# EAGLE schematic at32uc3a3256_usb_i2s (EAGLE 6.6.0)
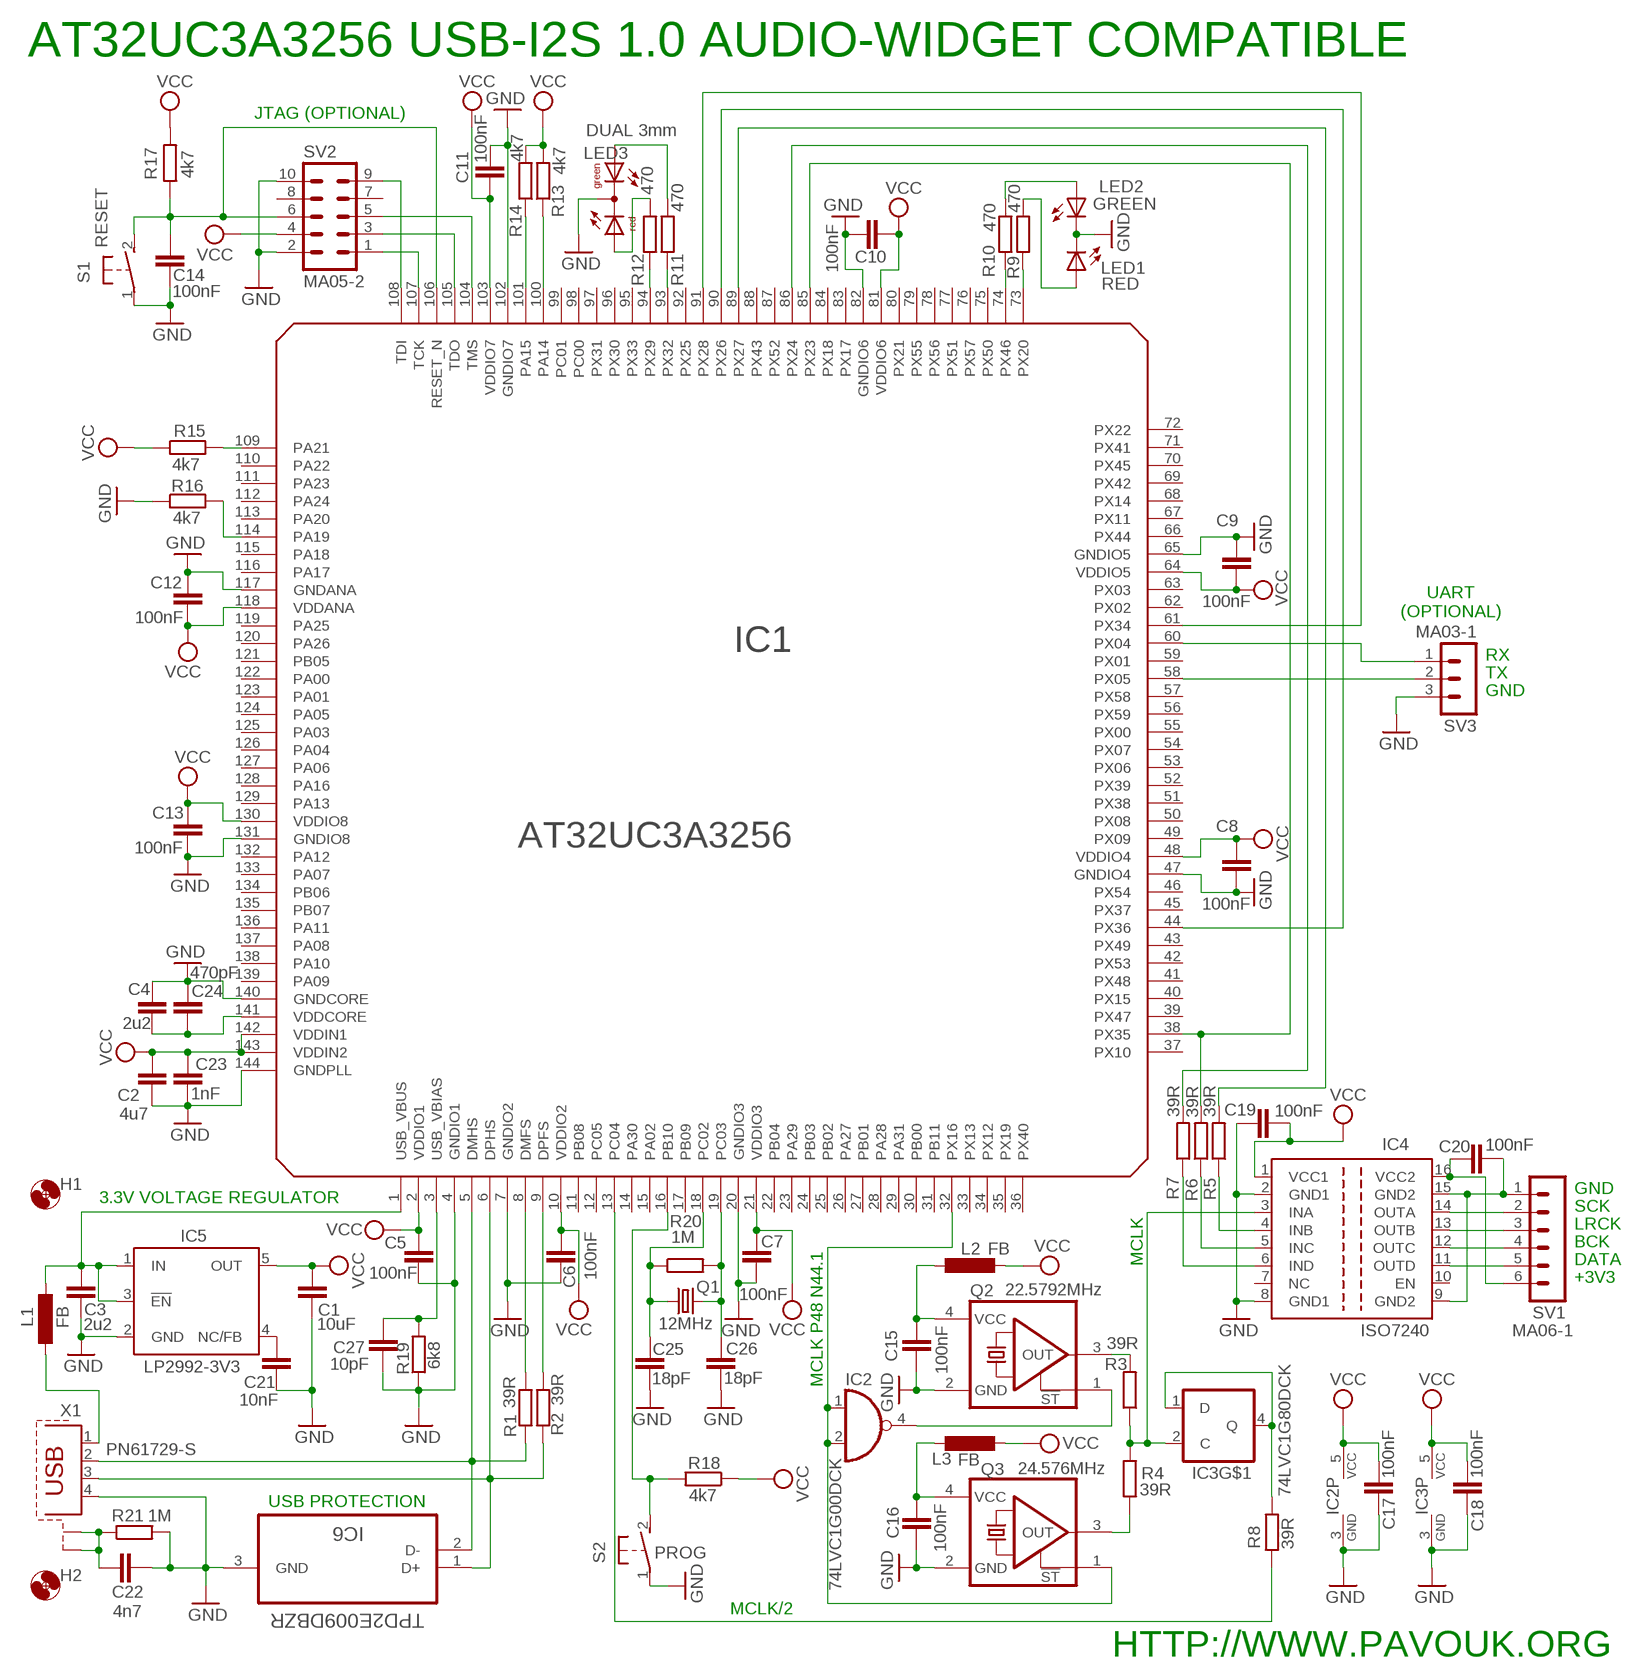
[diagram p0: schematic, sheet 1]

## Parts
C1  10uF  C-EUC0603  [C0603]
C2  4u7  C-EUC0603  [C0603]
C3  2u2  C-EUC0603  [C0603]
C4  2u2  C-EUC0603  [C0603]
C5  100nF  C-EUC0603  [C0603]
C6  100nF  C-EUC0603  [C0603]
C7  100nF  C-EUC0603  [C0603]
C8  100nF  C-EUC0603  [C0603]
C9  100nF  C-EUC0603  [C0603]
C10  100nF  C-EUC0603  [C0603]
C11  100nF  C-EUC0603  [C0603]
C12  100nF  C-EUC0603  [C0603]
C13  100nF  C-EUC0603  [C0603]
C14  100nF  C-EUC0603  [C0603]
C15  100nF  C-EUC0603  [C0603]
C16  100nF  C-EUC0603  [C0603]
C17  100nF  C-EUC0603  [C0603]
C18  100nF  C-EUC0603  [C0603]
C19  100nF  C-EUC0603  [C0603]
C20  100nF  C-EUC0603  [C0603]
C21  10nF  C-EUC0603  [C0603]
C22  4n7  C-EUC0603  [C0603]
C23  1nF  C-EUC0603  [C0603]
C24  470pF  C-EUC0603  [C0603]
C25  18pF  C-EUC0603  [C0603]
C26  18pF  C-EUC0603  [C0603]
C27  10pF  C-EUC0603  [C0603]
H1  MOUNT-HOLE3.2  [3,2]
H2  MOUNT-HOLE3.2  [3,2]
IC1  AT32UC3A3256  [LQFP144]
IC2  74LVC1G00DCK  [SC70-5]
IC3  74LVC1G80DCK  74LVC1G79DCK  [SC70-5]
IC4  ISO7240  [SO-16DW]
IC5  LP2992-3V3  TPS77001  [SOT23-DBV]
IC6  TPD2E009DBZR  [SOT95P237X112-3N]
L1  FB  L-EUL2012C  [L2012C]
L2  FB  L-EUL2012C  [L2012C]
L3  FB  L-EUL2012C  [L2012C]
LED1  RED  LEDCHIPLED_0603  [CHIPLED_0603]
LED2  GREEN  LEDCHIPLED_0603  [CHIPLED_0603]
LED3  DUAL 3mm  DUOLED5MM  [DUOLED5MM]
Q1  12MHz  CRYSTALCTS406  [CTS406]
Q2  22.5792MHz  CRYSTAL2.5X2  [CRYSTAL2.5X2]
Q3  24.576MHz  CRYSTAL2.5X2  [CRYSTAL2.5X2]
R1  39R  R-EU_R0603  [R0603]
R2  39R  R-EU_R0603  [R0603]
R3  39R  R-EU_R0603  [R0603]
R4  39R  R-EU_R0603  [R0603]
R5  39R  R-EU_R0603  [R0603]
R6  39R  R-EU_R0603  [R0603]
R7  39R  R-EU_R0603  [R0603]
R8  39R  R-EU_R0603  [R0603]
R9  470  R-EU_R0603  [R0603]
R10  470  R-EU_R0603  [R0603]
R11  470  R-EU_R0603  [R0603]
R12  470  R-EU_R0603  [R0603]
R13  4k7  R-EU_R0603  [R0603]
R14  4k7  R-EU_R0603  [R0603]
R15  4k7  R-EU_R0603  [R0603]
R16  4k7  R-EU_R0603  [R0603]
R17  4k7  R-EU_R0603  [R0603]
R18  4k7  R-EU_R0603  [R0603]
R19  6k8  R-EU_R0603  [R0603]
R20  1M  R-EU_R0603  [R0603]
R21  1M  R-EU_R0603  [R0603]
S1  RESET  SWITCH-KSR  [SWITCH-KSR]
S2  PROG  SWITCH-KSR  [SWITCH-KSR]
SV1  MA06-1  [MA06-1]
SV2  MA05-2  [MA05-2]
SV3  MA03-1  [MA03-1]
X1  PN61729-S  [PN61729-S]

## Nets
AD_LRCK: IC1.44(PX36) IC1.90(PX26)
AD_SCLK: IC1.61(PX34) IC1.91(PX28)
DA_LRCK: IC1.89(PX27) R5.2
DA_SCLK: IC1.38(PX35) IC1.85(PX23) R6.2
GND: C1.2 C2.2 C3.2 C4.1 C5.2 C6.2 C7.2 C8.2 C9.1 C10.1 C11.1 C12.1 C13.1 C14.2 C15.1 C16.1 C17.2 C18.2 C19.1 C21.2 C22.2 C23.2 C24.1 C25.2 C26.2 C27.2 IC1.4(GNDIO1) IC1.7(GNDIO2) IC1.20(GNDIO3) IC1.47(GNDIO4) IC1.65(GNDIO5) IC1.82(GNDIO6) IC1.102(GNDIO7) IC1.117(GNDANA) IC1.131(GNDIO8) IC1.140(GNDCORE) IC1.144(GNDPLL) IC2.3(GND) IC3.3(GND) IC4.2(GND1) IC4.8(GND1) IC5.2(GND) IC6.3(GND) LED1.C LED2.C LED3.K(C) Q2.2(GND) Q3.2(GND) R16.1 R19.1 R21.2 S1.1 S2.1 SV2.2 SV2.10 SV3.3 X1.4
GND2: C20.2 IC4.9(GND2) IC4.15(GND2) SV1.1
GPIO_05_LED2: IC1.94(PX29) R12.1
GPIO_08_LED1: IC1.93(PX32) R11.1
LRCK: IC4.4(INB) R5.1
MCLK: IC3.2(C) IC4.3(INA) R3.1 R4.2
MCLK_MCU: IC1.13(PC04) R8.1
MCLK_P48_N441: IC1.32(PX16) IC2.1(I0) IC2.2(I1) Q3.1(!ST)
N$1: C15.2 L2.2 Q2.4(VCC)
N$2: IC1.5(DMHS) IC6.2(D-) R1.1 X1.2
N$3: Q3.3(OUT) R4.1
N$4: Q2.3(OUT) R3.2
N$5: C16.2 L3.2 Q3.4(VCC)
N$6: IC1.6(DPHS) IC6.1(D+) R2.1 X1.3
N$7: IC1.8(DMFS) R1.2
N$8: C26.1 IC1.19(PC03) Q1.3 R20.2
N$9: C25.1 IC1.18(PC02) Q1.1 R20.1
N$10: IC1.9(DPFS) R2.2
N$11: C4.2 C24.2 IC1.141(VDDCORE)
N$12: IC1.108(TDI) SV2.9
N$13: IC1.114(PA19) R16.2
N$14: C22.1 R21.1 X1.S1 X1.S2
N$15: C27.1 IC1.3(USB_VBIAS) R19.2
N$16: C20.1 IC4.16(VCC2) SV1.6
N$17: IC4.14(OUTA) SV1.2
N$18: IC4.13(OUTB) SV1.3
N$19: IC4.12(OUTC) SV1.4
N$20: LED1.A R9.2
N$21: LED2.A R10.2
N$22: IC1.74(PX46) R10.1
N$23: IC1.73(PX20) R9.1
N$24: IC1.109(PA21) R15.2
N$25: IC1.101(PA15) R14.1
N$26: IC1.100(PA14) R13.1
N$27: IC4.11(OUTD) SV1.5
N$28: IC4.5(INC) R6.1
N$29: IC1.86(PX24) R7.2
N$30: IC4.6(IND) R7.1
N$31: IC3.1(D) IC3.4(Q) R8.2
N$32: L1.1 X1.1
N$33: LED3.AG R11.2
N$34: C21.1 IC5.4(NC/FB)
N$35: LED3.AR R12.2
N$36: IC2.4(O) Q2.1(!ST)
NSRST: C14.1 IC1.106(RESET_N) R17.1 S1.2 SV2.6
PROG: IC1.16(PB10) R18.2 S2.2
TCK: IC1.107(TCK) SV2.1
TDO: IC1.105(TDO) SV2.3
TMS: IC1.104(TMS) SV2.5
UART_RX: IC1.60(PX04) SV3.1
UART_TX: IC1.58(PX05) SV3.2
VBUS: C3.1 IC1.1(USB_VBUS) IC5.1(IN) IC5.3(!EN) L1.2
VCC: C1.1 C2.1 C5.1 C6.1 C7.1 C8.1 C9.2 C10.2 C11.2 C12.2 C13.2 C17.1 C18.1 C19.2 C23.1 IC1.2(VDDIO1) IC1.10(VDDIO2) IC1.21(VDDIO3) IC1.48(VDDIO4) IC1.64(VDDIO5) IC1.81(VDDIO6) IC1.103(VDDIO7) IC1.118(VDDANA) IC1.130(VDDIO8) IC1.142(VDDIN1) IC1.143(VDDIN2) IC2.5(VCC) IC3.5(VCC) IC4.1(VCC1) IC5.5(OUT) L2.1 L3.1 R13.2 R14.2 R15.1 R17.2 R18.1 SV2.4
Unconnected: IC1.11(PB08) IC1.12(PC05) IC1.14(PA30) IC1.15(PA02) IC1.17(PB09) IC1.22(PB04) IC1.23(PA29) IC1.24(PB03) IC1.25(PB02) IC1.26(PA27) IC1.27(PB01) IC1.28(PA28) IC1.29(PA31) IC1.30(PB00) IC1.31(PB11) IC1.33(PX13) IC1.34(PX12) IC1.35(PX19) IC1.36(PX40) IC1.37(PX10) IC1.39(PX47) IC1.40(PX15) IC1.41(PX48) IC1.42(PX53) IC1.43(PX49) IC1.45(PX37) IC1.46(PX54) IC1.49(PX09) IC1.50(PX08) IC1.51(PX38) IC1.52(PX39) IC1.53(PX06) IC1.54(PX07) IC1.55(PX00) IC1.56(PX59) IC1.57(PX58) IC1.59(PX01) IC1.62(PX02) IC1.63(PX03) IC1.66(PX44) IC1.67(PX11) IC1.68(PX14) IC1.69(PX42) IC1.70(PX45) IC1.71(PX41) IC1.72(PX22) IC1.75(PX50) IC1.76(PX57) IC1.77(PX51) IC1.78(PX56) IC1.79(PX55) IC1.80(PX21) IC1.83(PX17) IC1.84(PX18) IC1.87(PX52) IC1.88(PX43) IC1.92(PX25) IC1.95(PX33) IC1.96(PX30) IC1.97(PX31) IC1.98(PC00) IC1.99(PC01) IC1.110(PA22) IC1.111(PA23) IC1.112(PA24) IC1.113(PA20) IC1.115(PA18) IC1.116(PA17) IC1.119(PA25) IC1.120(PA26) IC1.121(PB05) IC1.122(PA00) IC1.123(PA01) IC1.124(PA05) IC1.125(PA03) IC1.126(PA04) IC1.127(PA06) IC1.128(PA16) IC1.129(PA13) IC1.132(PA12) IC1.133(PA07) IC1.134(PB06) IC1.135(PB07) IC1.136(PA11) IC1.137(PA08) IC1.138(PA10) IC1.139(PA09) IC4.7(NC) IC4.10(EN) SV2.7 SV2.8

## Notes on the sheet
- AT32UC3A3256 USB-I2S 1.0 AUDIO-WIDGET COMPATIBLE
- JTAG (OPTIONAL)
- UART
  (OPTIONAL)
- RX
- TX
- GND
- GND
- 3.3V VOLTAGE REGULATOR
- SCK
- LRCK
- BCK
- MCLK | DATA
- +3V3
- MCLK P48 N44.1
- USB PROTECTION
- MCLK/2
- HTTP://WWW.PAVOUK.ORG

## Library data of the parts
C1-C27 = rcl:C-EU: CAPACITOR, European symbol
H1 H2 = holes:MOUNT-HOLE: MOUNTING HOLE with drill center marker
IC1 = at32uc:AT32UC3A3256
IC2 = 74xx-little-de:74*1G00: 2-input NAND gate
IC3 = 74xx-little-de:74*1G79: Single Positive-Edge-Triggered D-Type Flip-Flop Source: Data sheet <http://www.ti.com/lit/ds/symlink/sn74lvc1g79.pdf>
IC4 = texas:ISO7240: HIGH SPEED QUAD DIGITAL ISOLATORS Source: http://focus.ti.com/lit/ds/symlink/iso7240m.pdf; MPN: ISO7240MDW; OC_FARNELL: 1755124; OC_NEWARK: 58M0385
IC5 = texas:TPS770*: ULTRALOW-POWER 50-mA LOW-DROPOUT LINEAR REGULATORS 50-mA Low-Dropout Regulator Source: http://focus.ti.com/lit/ds/symlink/tps77001.pdf; MF: TEXAS INSTRUMENTS; MPN: TPS77001DBVT; OC_FARNELL: 8461554; OC_NEWARK: 77C1171
IC6 = pavouk:TPD2E009DBZR: (6 GBPS) DIFFERENTIAL INTERFACE; MPN: TPD2E009DBZR; OC_FARNELL: 1755715; OC_NEWARK: 14R9549; PACKAGE: SOT-23-3; SUPPLIER: Texas Instruments
L1-L3 = rcl:L-EU: INDUCTOR, European symbol
LED1 LED2 = led:LED: LED OSRAM: - CHIPLED LG R971, LG N971, LY N971, LG Q971, LY Q971, LO R971, LY R971 LH N974, LH R974 LS Q976, LO Q976, LY Q976 LO Q996 - Hyper CHIPLED LW Q18S LB Q993, LB Q99A, LB R99A - SideLED LS A670, LO A670, LY A670, LG A670, LP A670 LB A673, LV A673, LT A673, LW A673 LH A674 LY A675 LS A676, LA A676, LO A676, LY A676, LW A676 LS A679, LY A679, LG A679 - Hyper Micro SIDELED® LS Y876, LA Y876, LO Y876, LY Y876 LT Y87S - SmartLED LW L88C, LW L88S LB L89C, LB L89S, LG L890 LS L89K, LO L89K, LY L89K LS L896, LA L896, LO L896, LY L896 - TOPLED LS T670, LO T670, LY T670, LG T670, LP T670 LSG T670, LSP T670, LSY T670, LOP T670, LYG T670 LG T671, LOG T671, LSG T671 LB T673, LV T673, LT T673, LW T673 LH T674 LS T676, LA T676, LO T676, LY T676, LB T676, LH T676, LSB T676, LW T676 LB T67C, LV T67C, LT T67C, LS T67K, LO T67K, LY T67K, LW E67C LS E67B, LA E67B, LO E67B, LY E67B, LB E67C, LV E67C, LT E67C LW T67C LS T679, LY T679, LG T679 LS T770, LO T770, LY T770, LG T770, LP T770 LB T773, LV T773, LT T773, LW T773 LH T774 LS E675, LA E675, LY E675, LS T675 LS T776, LA T776, LO T776, LY T776, LB T776 LHGB T686 LT T68C, LB T68C - Hyper Mini TOPLED® LB M676 - Mini TOPLED Santana® LG M470 LS M47K, LO M47K, LY M47K Source: http://www.osram.convergy.de LUXEON: - LUMILED® LXK2-PW12-R00, LXK2-PW12-S00, LXK2-PW14-U00, LXK2-PW14-V00 LXK2-PM12-R00, LXK2-PM12-S00, LXK2-PM14-U00 LXK2-PE12-Q00, LXK2-PE12-R00, LXK2-PE12-S00, LXK2-PE14-T00, LXK2-PE14-U00 LXK2-PB12-K00, LXK2-PB12-L00, LXK2-PB12-M00, LXK2-PB14-N00, LXK2-PB14-P00, LXK2-PB14-Q00 LXK2-PR12-L00, LXK2-PR12-M00, LXK2-PR14-Q00, LXK2-PR14-R00 LXK2-PD12-Q00, LXK2-PD12-R00, LXK2-PD12-S00 LXK2-PH12-R00, LXK2-PH12-S00 LXK2-PL12-P00, LXK2-PL12-Q00, LXK2-PL12-R00 Source: www.luxeon.com KINGBRIGHT: KA-3528ASYC Source: www.kingbright.com
LED3 = led:DUOLED5MM: DUO LED 2 colors, 5 mm, round
Q1 = crystal:CRYSTAL: CRYSTAL; OC_FARNELL: unknown; OC_NEWARK: unknown
Q2 Q3 = pavouk:CRYSTAL2.5X2: CRYSTAL OSCILLATOR 2.5mm x 2 mm
R1-R21 = rcl:R-EU_: RESISTOR, European symbol
S1 S2 = pavouk:SWITCH-KSR: KSR Series Subminiature Tact Switch for SMT
SV1 = con-lstb:MA06-1: PIN HEADER; OC_FARNELL: unknown; OC_NEWARK: unknown
SV2 = con-lstb:MA05-2: PIN HEADER; OC_FARNELL: unknown; OC_NEWARK: unknown
SV3 = con-lstb:MA03-1: PIN HEADER; OC_FARNELL: unknown; OC_NEWARK: unknown
X1 = con-berg:PN61729-S: BERG USB connector; OC_FARNELL: unknown; OC_NEWARK: unknown